# EAGLE design eBike Controller_v2 (EAGLE 6.4)
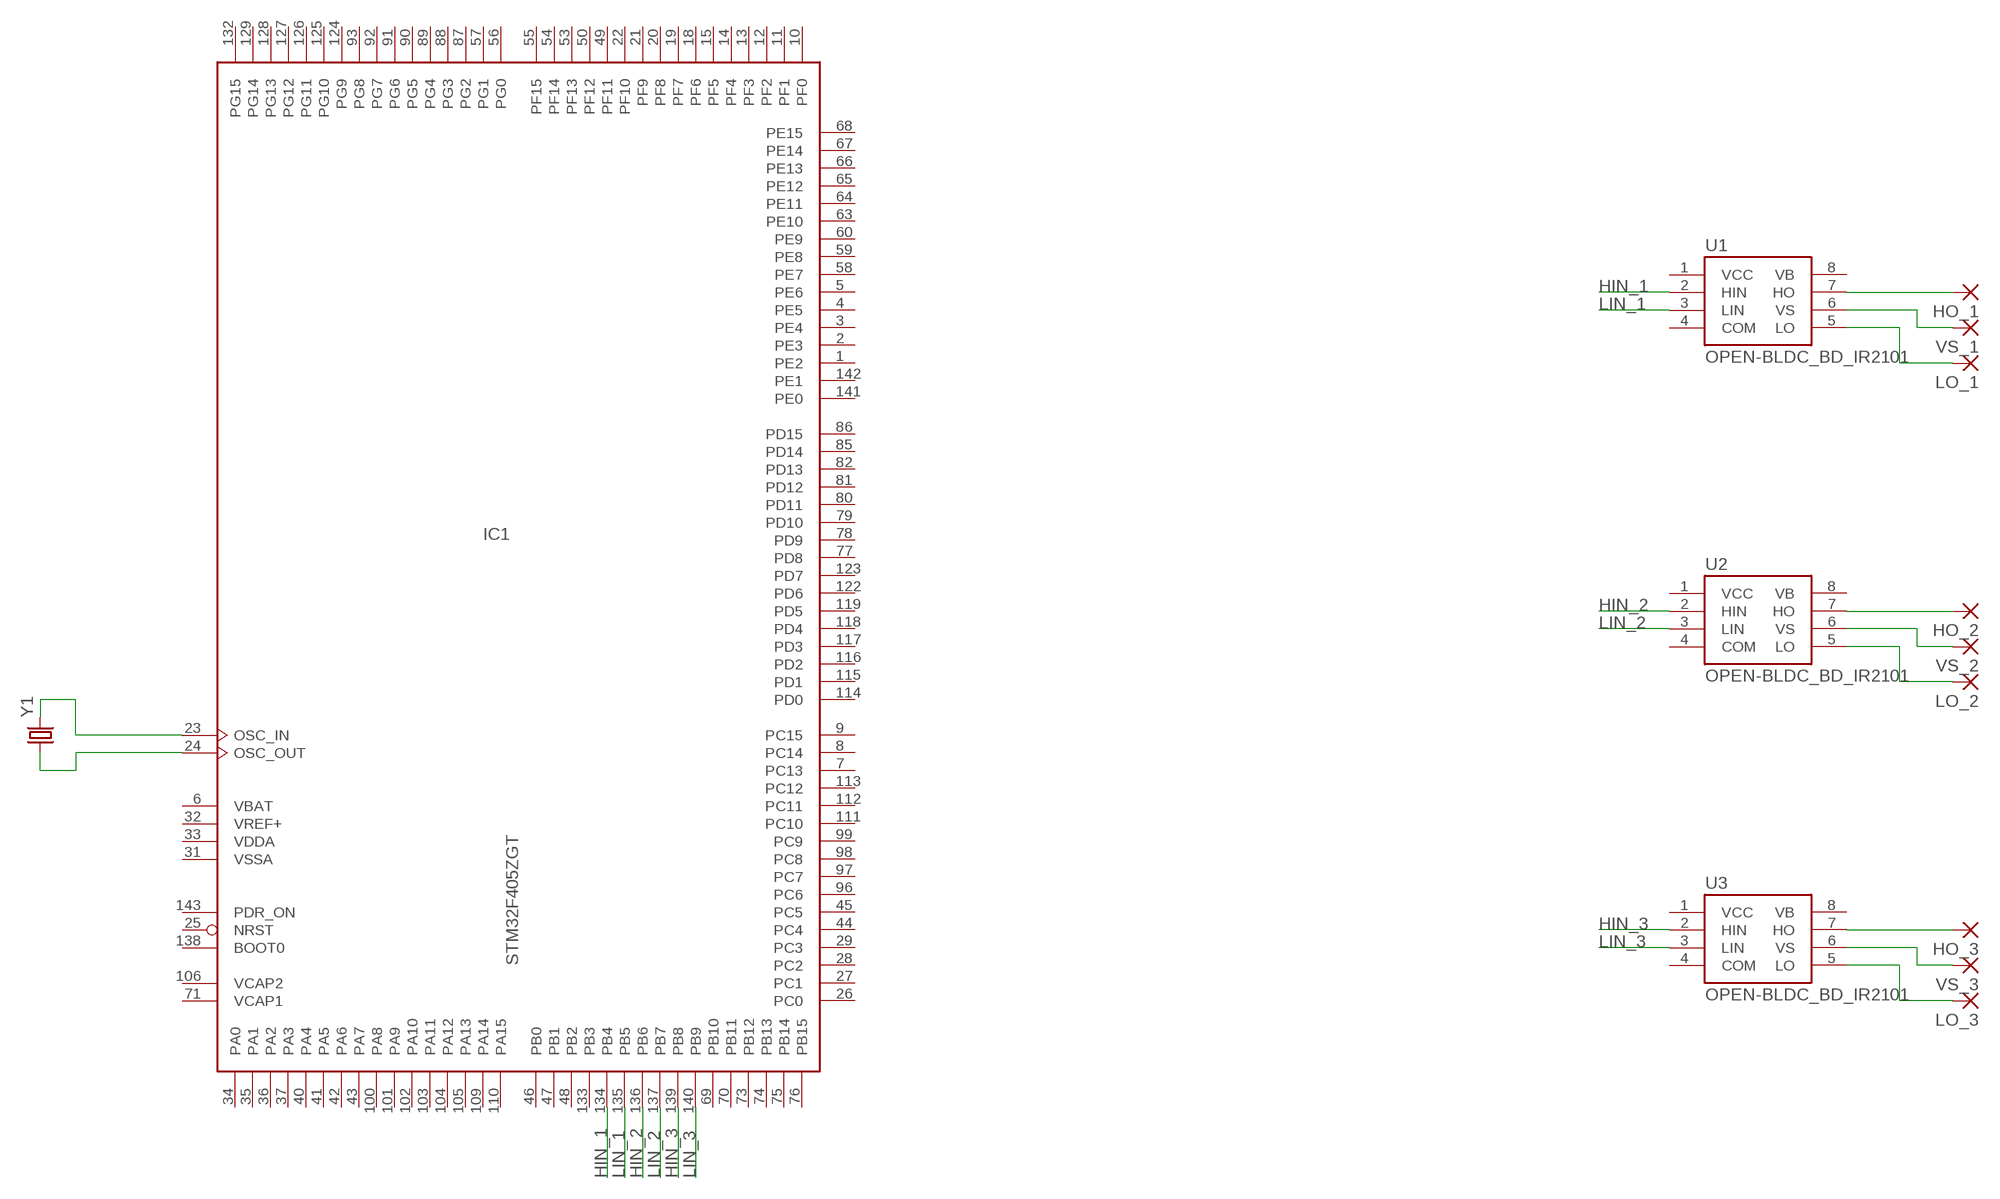
[diagram p0: schematic, sheet 1]

## Parts
HO_1  3,81/1,4  [3,81/1,4]
HO_2  3,81/1,4  [3,81/1,4]
HO_3  3,81/1,4  [3,81/1,4]
IC1  STM32F405ZGT  [LQFP144]
LO_1  3,81/1,4  [3,81/1,4]
LO_2  3,81/1,4  [3,81/1,4]
LO_3  3,81/1,4  [3,81/1,4]
U1  OPEN-BLDC_BD_IR2101  [OPEN-BLDC_SO8]
U2  OPEN-BLDC_BD_IR2101  [OPEN-BLDC_SO8]
U3  OPEN-BLDC_BD_IR2101  [OPEN-BLDC_SO8]
VS_1  3,81/1,4  [3,81/1,4]
VS_2  3,81/1,4  [3,81/1,4]
VS_3  3,81/1,4  [3,81/1,4]
Y1  CRYSTALHC49US  [HC49US]

## Nets
HIN_1: IC1.134(PB4) U1.2(HIN)
HIN_2: IC1.136(PB6) U2.2(HIN)
HIN_3: IC1.139(PB8) U3.2(HIN)
HO_1: HO_1.1(P) U1.7(HO)
HO_2: HO_2.1(P) U2.7(HO)
HO_3: HO_3.1(P) U3.7(HO)
LIN_1: IC1.135(PB5) U1.3(LIN)
LIN_2: IC1.137(PB7) U2.3(LIN)
LIN_3: IC1.140(PB9) U3.3(LIN)
LO_1: LO_1.1(P) U1.5(LO)
LO_2: LO_2.1(P) U2.5(LO)
LO_3: LO_3.1(P) U3.5(LO)
N$10: IC1.24(OSC_OUT) Y1.1
N$11: IC1.23(OSC_IN) Y1.2
VS_1: U1.6(VS) VS_1.1(P)
VS_2: U2.6(VS) VS_2.1(P)
VS_3: U3.6(VS) VS_3.1(P)
Unconnected: IC1.1(PE2) IC1.2(PE3) IC1.3(PE4) IC1.4(PE5) IC1.5(PE6) IC1.7(PC13) IC1.8(PC14) IC1.9(PC15) IC1.10(PF0) IC1.11(PF1) IC1.12(PF2) IC1.13(PF3) IC1.14(PF4) IC1.15(PF5) IC1.18(PF6) IC1.19(PF7) IC1.20(PF8) IC1.21(PF9) IC1.22(PF10) IC1.25(NRST) IC1.26(PC0) IC1.27(PC1) IC1.28(PC2) IC1.29(PC3) IC1.34(PA0) IC1.35(PA1) IC1.36(PA2) IC1.37(PA3) IC1.40(PA4) IC1.41(PA5) IC1.42(PA6) IC1.43(PA7) IC1.44(PC4) IC1.45(PC5) IC1.46(PB0) IC1.47(PB1) IC1.48(PB2) IC1.49(PF11) IC1.50(PF12) IC1.53(PF13) IC1.54(PF14) IC1.55(PF15) IC1.56(PG0) IC1.57(PG1) IC1.58(PE7) IC1.59(PE8) IC1.60(PE9) IC1.63(PE10) IC1.64(PE11) IC1.65(PE12) IC1.66(PE13) IC1.67(PE14) IC1.68(PE15) IC1.69(PB10) IC1.70(PB11) IC1.73(PB12) IC1.74(PB13) IC1.75(PB14) IC1.76(PB15) IC1.77(PD8) IC1.78(PD9) IC1.79(PD10) IC1.80(PD11) IC1.81(PD12) IC1.82(PD13) IC1.85(PD14) IC1.86(PD15) IC1.87(PG2) IC1.88(PG3) IC1.89(PG4) IC1.90(PG5) IC1.91(PG6) IC1.92(PG7) IC1.93(PG8) IC1.96(PC6) IC1.97(PC7) IC1.98(PC8) IC1.99(PC9) IC1.100(PA8) IC1.101(PA9) IC1.102(PA10) IC1.103(PA11) IC1.104(PA12) IC1.105(PA13) IC1.109(PA14) IC1.110(PA15) IC1.111(PC10) IC1.112(PC11) IC1.113(PC12) IC1.114(PD0) IC1.115(PD1) IC1.116(PD2) IC1.117(PD3) IC1.118(PD4) IC1.119(PD5) IC1.122(PD6) IC1.123(PD7) IC1.124(PG9) IC1.125(PG10) IC1.126(PG11) IC1.127(PG12) IC1.128(PG13) IC1.129(PG14) IC1.132(PG15) IC1.133(PB3) IC1.138(BOOT0) IC1.141(PE0) IC1.142(PE1) IC1.143(PDR_ON) U1.1(VCC) U1.4(COM) U1.8(VB) U2.1(VCC) U2.4(COM) U2.8(VB) U3.1(VCC) U3.4(COM) U3.8(VB)

## Power pins joined to a net without a drawn wire
VBAT: IC1.6(VBAT)
VCAP1: IC1.71(VCAP1)
VCAP2: IC1.106(VCAP2)
VDD: IC1.17(VDD) IC1.30(VDD) IC1.39(VDD) IC1.52(VDD) IC1.62(VDD) IC1.72(VDD) IC1.84(VDD) IC1.95(VDD) IC1.108(VDD) IC1.121(VDD) IC1.131(VDD) IC1.144(VDD)
VDDA: IC1.33(VDDA)
VREF+: IC1.32(VREF+)
VSS: IC1.16(VSS) IC1.38(VSS) IC1.51(VSS) IC1.61(VSS) IC1.83(VSS) IC1.94(VSS) IC1.107(VSS) IC1.120(VSS) IC1.130(VSS)
VSSA: IC1.31(VSSA)

## Library data of the parts
HO_1-HO_3 LO_1-LO_3 VS_1-VS_3 = wirepad:3,81/1,4: THROUGH-HOLE PAD
IC1 = micro-stm_v3:STM32F405Z*T: ARM 32-bit Cortex™-M3 CPU 168 MHz maximum frequency 1024 Kbytes of Flash memory 192 kbytes of SRAM 114 GPIOs 1.8 to 3.6 V application supply
U1-U3 = power_control:OPEN-BLDC_BD
Y1 = SparkFun-FreqCtrl:CRYSTAL: Various standard crystals. Proven footprints. Spark Fun Electronics SKU : COM-00534

## Board
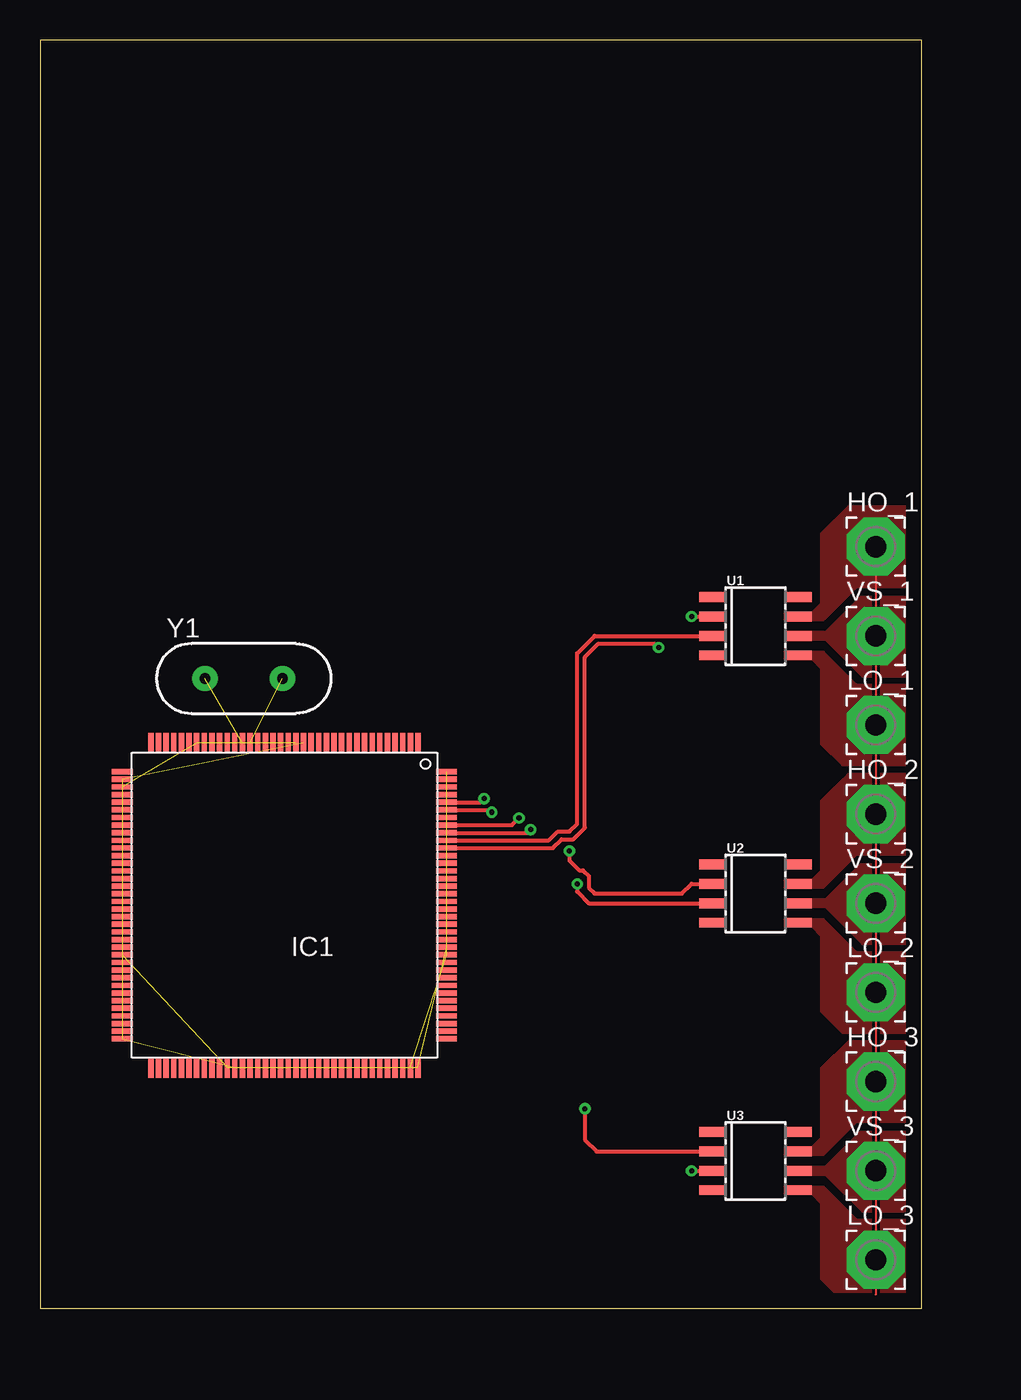
[diagram p1: board, top side]
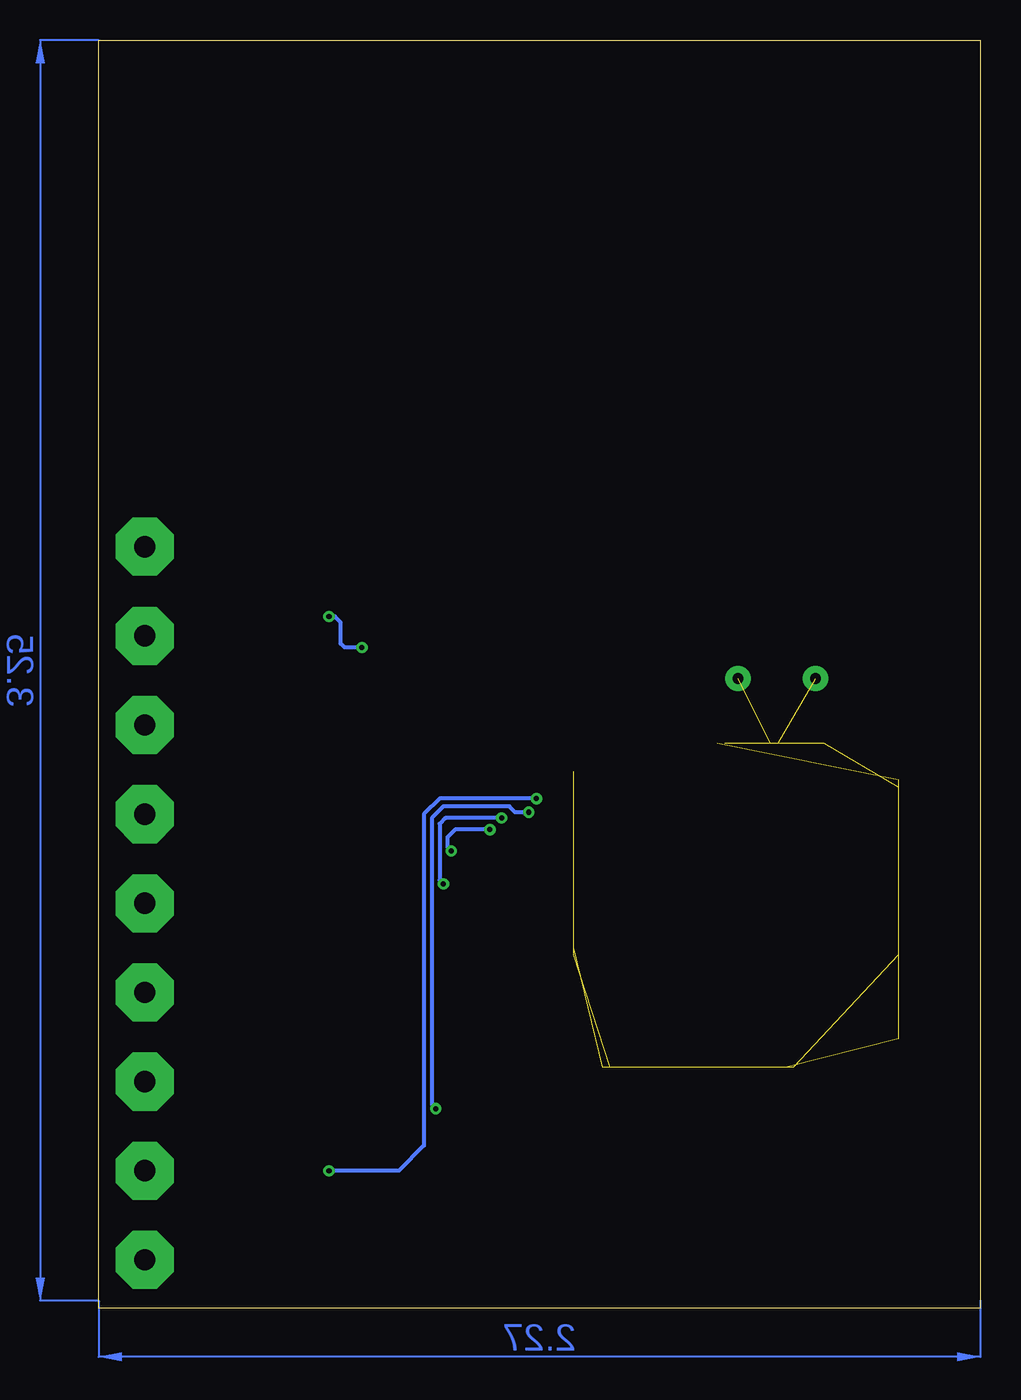
[diagram p2: board, bottom side, seen from below]

Size 57.77 x 83.11 mm. Coordinates in mm from the lower left corner, seen from the top.
Outline: 0,0 57.77,0 57.77,83.11 0,83.11 0,0
Copper layers (1*16): Top 0.035mm / dielectric 1.5mm / Bottom 0.035mm
Design rules "default": minimum track width 10mil, minimum drill 24mil, track to track 8mil, track to pad 8mil, pad to pad 8mil, via to via 8mil, smd to smd 8mil, copper to edge 40mil, drill to drill 8mil, minimum pad ring 10mil, minimum via ring 8mil, stop-mask expansion 4mil, vias tented up to drill 0mil, thermal gap 10mil

### Footprints (pad centres in the part's own frame; a part is rotated, then mirrored left to right if it is on the bottom)
3,81/1,4 = drill 1.397 pad 3.81 octagon: 1 0,0
LQFP144 = smd 0.35 x 1.35: 1 -8.75,-10.625; 2 -8.25,-10.625; 3 -7.75,-10.625; 4 -7.25,-10.625; 5 -6.75,-10.625; 6 -6.25,-10.625; 7 -5.75,-10.625; 8 -5.25,-10.625; 9 -4.75,-10.625; 10 -4.25,-10.625; 11 -3.75,-10.625; 12 -3.25,-10.625; 13 -2.75,-10.62; 14 -2.25,-10.625; 15 -1.75,-10.625; 16 -1.25,-10.625; 17 -0.75,-10.625; 18 -0.25,-10.625; 19 0.25,-10.625; 20 0.75,-10.625; 21 1.25,-10.625; 22 1.75,-10.625; 23 2.25,-10.625; 24 2.75,-10.62; 25 3.25,-10.625; 26 3.75,-10.625; 27 4.25,-10.625; 28 4.75,-10.625; 29 5.25,-10.625; 30 5.75,-10.625; 31 6.25,-10.625; 32 6.75,-10.625; 33 7.25,-10.625; 34 7.75,-10.625; 35 8.25,-10.625; 36 8.75,-10.625; 73 8.75,10.625; 74 8.25,10.625; 75 7.75,10.625; 76 7.25,10.625; 77 6.75,10.625; 78 6.25,10.625; 79 5.75,10.625; 80 5.25,10.625; 81 4.75,10.625; 82 4.25,10.625; 83 3.75,10.625; 84 3.25,10.625; 85 2.75,10.625; 86 2.25,10.625; 87 1.75,10.625; 88 1.25,10.625; 89 0.75,10.625; 90 0.25,10.625; 91 -0.25,10.625; 92 -0.75,10.625; 93 -1.25,10.625; 94 -1.75,10.625; 95 -2.25,10.625; 96 -2.75,10.625; 97 -3.25,10.625; 98 -3.75,10.625; 99 -4.25,10.625; 100 -4.75,10.625; 101 -5.25,10.625; 102 -5.75,10.625; 103 -6.25,10.625; 104 -6.75,10.625; 105 -7.25,10.625; 106 -7.75,10.625; 107 -8.25,10.625; 108 -8.75,10.625 | smd 1.35 x 0.35: 37 10.625,-8.75; 38 10.625,-8.25; 39 10.625,-7.75; 40 10.625,-7.25; 41 10.625,-6.75; 42 10.625,-6.25; 43 10.625,-5.75; 44 10.625,-5.25; 45 10.625,-4.75; 46 10.625,-4.25; 47 10.625,-3.75; 48 10.625,-3.25; 49 10.625,-2.75; 50 10.625,-2.25; 51 10.625,-1.75; 52 10.625,-1.25; 53 10.625,-0.75; 54 10.625,-0.25; 55 10.625,0.25; 56 10.625,0.75; 57 10.625,1.25; 58 10.625,1.75; 59 10.625,2.25; 60 10.625,2.75; 61 10.625,3.25; 62 10.625,3.75; 63 10.625,4.25; 64 10.625,4.75; 65 10.625,5.25; 66 10.625,5.75; 67 10.625,6.25; 68 10.625,6.75; 69 10.625,7.25; 70 10.625,7.75; 71 10.625,8.25; 72 10.625,8.75; 109 -10.625,8.75; 110 -10.625,8.25; 111 -10.625,7.75; 112 -10.625,7.25; 113 -10.625,6.75; 114 -10.625,6.25; 115 -10.625,5.75; 116 -10.625,5.25; 117 -10.625,4.75; 118 -10.625,4.25; 119 -10.625,3.75; 120 -10.625,3.25; 121 -10.625,2.75; 122 -10.625,2.25; 123 -10.625,1.75; 124 -10.625,1.25; 125 -10.625,0.75; 126 -10.625,0.25; 127 -10.625,-0.25; 128 -10.625,-0.75; 129 -10.625,-1.25; 130 -10.625,-1.75; 131 -10.625,-2.25; 132 -10.625,-2.75; 133 -10.625,-3.25; 134 -10.625,-3.75; 135 -10.625,-4.25; 136 -10.625,-4.75; 137 -10.625,-5.25; 138 -10.625,-5.75; 139 -10.625,-6.25; 140 -10.625,-6.75; 141 -10.625,-7.25; 142 -10.625,-7.75; 143 -10.625,-8.25; 144 -10.625,-8.75
OPEN-BLDC_SO8 = smd 0.65 x 1.75: 1 -1.905,-2.8; 2 -0.635,-2.8; 3 0.635,-2.8; 4 1.905,-2.8; 5 1.905,2.8; 6 0.635,2.8; 7 -0.635,2.8; 8 -1.905,2.8
HC49US = drill 0.7 pad 1.651: 1 -2.54,0; 2 2.54,0

### Placement (x,y rotation side)
HO_1  54.74,49.91 0 top
HO_2  54.74,32.39 0 top
HO_3  54.74,14.86 0 top
IC1  16,26.42 180 top
LO_1  54.74,38.23 0 top
LO_2  54.74,20.7 0 top
LO_3  54.74,3.18 0 top
U1  46.86,44.7 270 top
U2  46.86,27.18 270 top
U3  46.86,9.65 270 top
VS_1  54.74,44.07 0 top
VS_2  54.74,26.54 0 top
VS_3  54.74,9.02 0 top
Y1  13.34,41.28 0 top

### Tracks (layer width: path | path; a pad name or v marks a point on that pad's centre or on a via)
HIN_1  (via drill 0.33)
  Top 0.254: IC1.134 33.6,30.17 34.16,30.73 34.93,30.73 35.69,31.5 35.69,42.67 36.58,43.56 40.26,43.56 v40.51,43.31 | v42.67,45.34 U1.2
  Bottom 0.254: v40.51,43.31 41.66,43.31 41.91,43.56 41.91,44.96 42.29,45.34 v42.67,45.34
HIN_2  (via drill 0.33)
  Top 0.254: IC1.136 31.93,31.17 v32.13,31.37 | v34.67,29.97 34.67,29.34 35.31,28.7 35.56,28.7 35.94,28.32 35.94,27.56 36.32,27.18 42.04,27.18 42.67,27.81 U2.2
  Bottom 0.254: v32.13,31.37 34.42,31.37 34.93,30.86 34.93,30.23 v34.67,29.97
HIN_3  (via drill 0.33)
  Top 0.254: IC1.139 29.44,32.67 v29.59,32.51 | v35.69,13.08 35.69,11.05 36.45,10.29 U3.2
  Bottom 0.254: v29.59,32.51 30.48,32.51 30.86,32.89 35.18,32.89 35.94,32.13 35.94,13.34 v35.69,13.08
HO_1
  Top 0.127: HO_1.1 54.74,0.89
  pour Top (no thermals): 57.15,52.58 57.15,47.24 53.47,47.24 51.31,45.09 48.77,45.09 48.77,45.59 50.55,45.59 51.18,46.23 51.18,50.8 52.96,52.58
HO_2
  pour Top (no thermals): 57.15,35.05 57.15,29.72 53.47,29.72 51.31,27.56 48.77,27.56 48.77,28.07 50.55,28.07 51.18,28.7 51.18,33.27 52.96,35.05
HO_3
  pour Top (no thermals): 57.15,17.53 57.15,12.19 53.47,12.19 51.31,10.03 48.77,10.03 48.77,10.54 50.55,10.54 51.18,11.18 51.18,15.75 52.96,17.53
LIN_1
  Top 0.254: IC1.135 33.33,30.67 33.91,31.24 34.67,31.24 35.18,31.75 35.18,42.93 36.32,44.07 U1.3
LIN_2  (via drill 0.33)
  Top 0.254: IC1.137 30.9,31.67 v31.37,32.13 | v35.18,27.81 35.18,27.31 35.94,26.54 U2.3
  Bottom 0.254: v31.37,32.13 35.05,32.13 35.43,31.75 35.43,28.07 v35.18,27.81
LIN_3  (via drill 0.33)
  Top 0.254: IC1.140 28.85,33.17 v29.08,33.4 | v42.67,9.02 U3.3
  Bottom 0.254: v29.08,33.4 35.43,33.4 36.45,32.39 36.45,10.67 38.1,9.02 v42.67,9.02
LO_1
  pour Top (no thermals): 48.77,43.05 51.31,43.05 53.47,40.89 57.15,40.89 57.15,35.56 52.58,35.56 51.18,36.96 51.18,41.91 50.55,42.55 48.77,42.55
LO_2
  pour Top (no thermals): 48.77,25.53 51.31,25.53 53.47,23.37 57.15,23.37 57.15,18.03 52.58,18.03 51.18,19.43 51.18,24.38 50.55,25.02 48.77,25.02
LO_3
  pour Top (no thermals): 48.77,8 51.31,8 53.47,5.84 57.15,5.84 57.15,0.51 52.58,0.51 51.18,1.91 51.18,6.86 50.55,7.49 48.77,7.49
N$10  (1 unrouted)
N$11  (1 unrouted)
VDD  (11 unrouted)
VS_1
  pour Top (no thermals): 57.15,46.61 53.72,46.61 51.56,44.45 51.44,44.32 48.77,44.32 48.77,43.81 51.44,43.81 53.85,41.4 57.15,41.4
VS_2
  pour Top (no thermals): 57.15,29.08 53.72,29.08 51.56,26.92 51.44,26.8 48.77,26.8 48.77,26.29 51.44,26.29 53.85,23.88 57.15,23.88
VS_3
  pour Top (no thermals): 57.15,11.56 53.72,11.56 51.56,9.4 51.44,9.27 48.77,9.27 48.77,8.76 51.44,8.76 53.85,6.35 57.15,6.35
VSS  (8 unrouted)
(copper drawn outside any net)
  shapes: Bottom area x2